# EAGLE design soundthings (EAGLE 7.7.0)
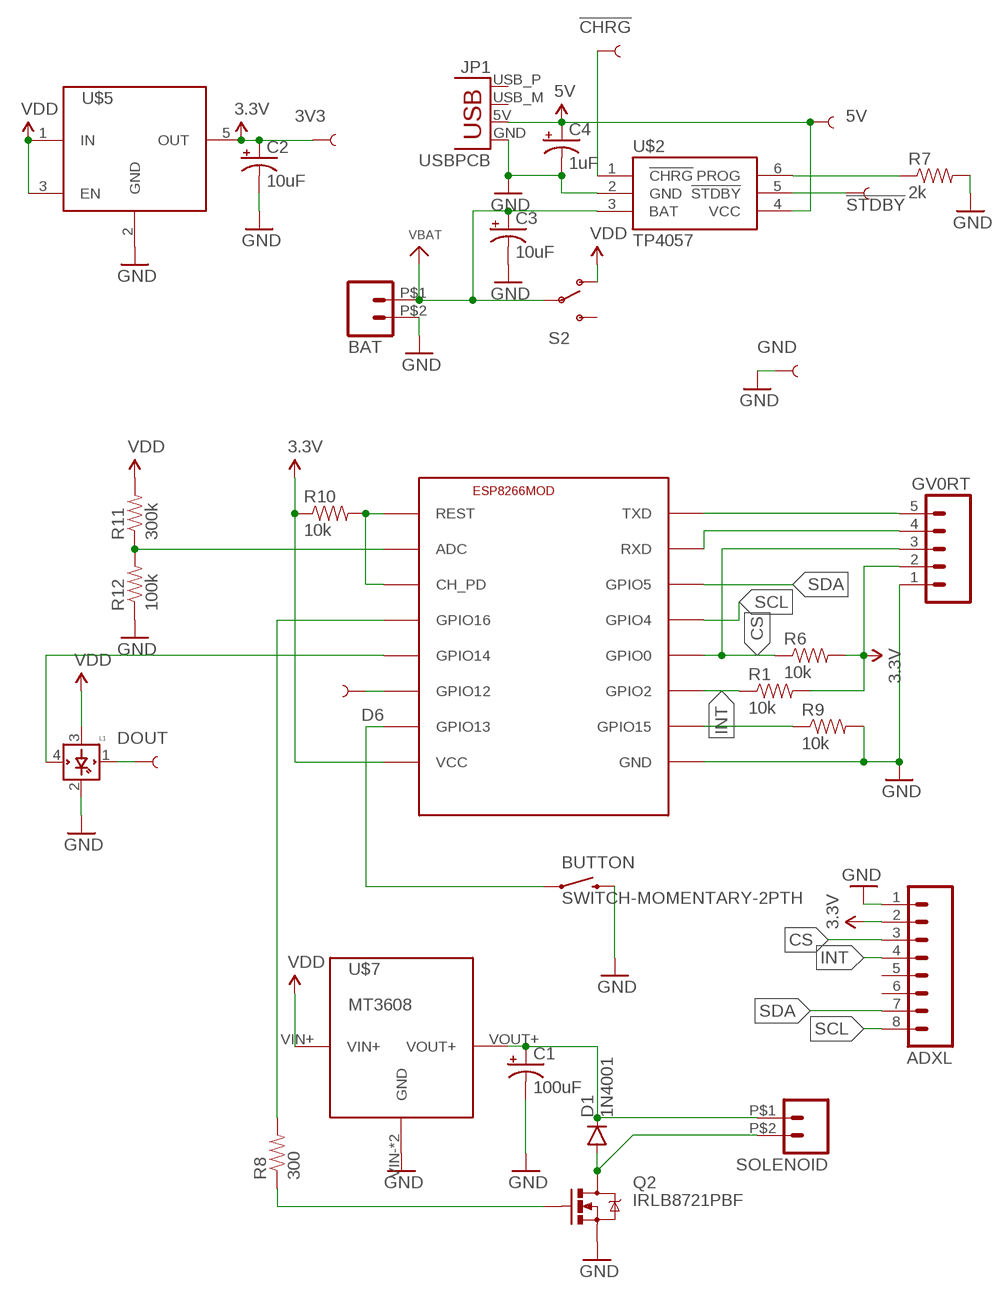
[diagram p0: schematic, sheet 1]

## Parts
3V3  TEST-POINTTP_15TH_THRU  [TP_15TH]
5V  TEST-POINTTP_15TH_THRU  [TP_15TH]
!CHRG  TEST-POINTTP_15TH_THRU  [TP_15TH]
!STDBY  TEST-POINTTP_15TH_THRU  [TP_15TH]
ADXL  M08LOCK  [1X08_LOCK]
BAT  M02PTH2  [1X02_BIG]
BUTTON  SWITCH-MOMENTARY-2PTH  [TACTILE-PTH]
C1  100uF  100UF-25V-20%(PTH)  [CPOL-RADIAL-100UF-25V]
C2  10uF  100UF-25V-20%(PTH)  [CPOL-RADIAL-100UF-25V]
C3  10uF  100UF-25V-20%(PTH)  [CPOL-RADIAL-100UF-25V]
C4  1uF  100UF-25V-20%(PTH)  [CPOL-RADIAL-100UF-25V]
D1  1N4001  DIODE1N4148  [DIODE-1N4148]
D6  TEST-POINTTP_15TH_THRU  [TP_15TH]
DOUT  TEST-POINTTP_15TH_THRU  [TP_15TH]
ESP8266MOD  ESP8266-07  [ESP-07]
GND  TEST-POINTTP_15TH_THRU  [TP_15TH]
GV0RT  M05LOCK  [1X05_LOCK]
JP1  USBPCB  [USB-A-PCB]
L1  WS2812BTH  [WS2812F5]
Q2  IRLB8721PBF  MOSFET-NCHANNELFQP30N06L  [TO220V]
R1  10k  RESISTORAXIAL-0.3  [AXIAL-0.3]
R6  10k  RESISTORAXIAL-0.3  [AXIAL-0.3]
R7  2k  RESISTORAXIAL-0.3  [AXIAL-0.3]
R8  300  RESISTORAXIAL-0.3  [AXIAL-0.3]
R9  10k  RESISTORAXIAL-0.3  [AXIAL-0.3]
R10  10k  RESISTORAXIAL-0.3  [AXIAL-0.3]
R11  300k  RESISTORAXIAL-0.3  [AXIAL-0.3]
R12  100k  RESISTORAXIAL-0.3  [AXIAL-0.3]
S2  SWITCH-SPDT-1  [MHS122-1]
SOLENOID  M02PTH2  [1X02_BIG]
U$2  TP4057  TP4057SOT-26-R  [SOT23-6]
U$5  TLV70233  [SOT23-5]
U$7  MT3608  [MT3608]

## Nets
3.3V: 3V3.P$1 ADXL.2 C2.1(+) ESP8266MOD.VCC GV0RT.2 R1.P$2 R6.P$2 R10.P$1 U$5.5(OUT)
5V [power]: 5V.P$1 C4.1(+) JP1.5V(VBUS) U$2.4(VCC)
!CHRG: !CHRG.P$1 U$2.1(!CHRG)
!STDBY: !STDBY.P$1 U$2.5(!STDBY)
ADC: ESP8266MOD.ADC R11.P$1 R12.P$2
CS: ADXL.3 ESP8266MOD.GPIO0 GV0RT.3 R6.P$1
DOUT: DOUT.P$1 L1.1(DOUT)
EN: ESP8266MOD.CH_PD ESP8266MOD.REST R10.P$2
GATE: Q2.1(G) R8.P$1
GND [ground]: ADXL.1 BAT.P$2 BUTTON.3 C1.2(-) C2.2(-) C3.2(-) C4.2(-) ESP8266MOD.GND GND.P$1 GV0RT.1 JP1.GND L1.2(GND) Q2.3(S) R7.P$2 R9.P$2 R12.P$1 U$2.2(GND) U$5.2(GND) U$7.VIN-(GND) U$7.VOUT-(GND)
GPIO12: D6.P$1 ESP8266MOD.GPIO12
GPIO13: BUTTON.1 ESP8266MOD.GPIO13
GPIO14: ESP8266MOD.GPIO14 L1.4(DIN)
GPIO15: ESP8266MOD.GPIO15 R9.P$1
GPIO16: ESP8266MOD.GPIO16 R8.P$2
INT: ADXL.4 ESP8266MOD.GPIO2 R1.P$1
N$11: R7.P$1 U$2.6(PROG)
RX: ESP8266MOD.RXD GV0RT.4
SCL: ADXL.8 ESP8266MOD.GPIO5(GPIO4)
SDA: ADXL.7 ESP8266MOD.GPIO4(GPIO5)
SOL- [power]: D1.A Q2.2(D) SOLENOID.P$2
TX: ESP8266MOD.TXD GV0RT.5
VBAT [power]: BAT.P$1 C3.1(+) S2.2(P) U$2.3(BAT)
VDD: L1.3(VDD) R11.P$2 S2.1(O) U$5.1(IN) U$5.3(EN) U$7.VIN+
VOUT+ [power]: C1.1(+) D1.C SOLENOID.P$1 U$7.VOUT+
Unconnected: ADXL.5 ADXL.6 JP1.USB_M(D-) JP1.USB_P(D+) S2.3(S)

## Library data of the parts
3V3 5V !CHRG !STDBY D6 DOUT GND = SparkFun-Passives:TEST-POINT: Bare copper test points for troubleshooting or ICT
ADXL = SparkFun-Connectors:M08: Header 8 Standard 8-pin 0.1" header. Use with straight break away headers (SKU : PRT-00116), right angle break away headers (PRT-00553), swiss pins (PRT-00743), machine pins (PRT-00117), and female headers (PRT-00115).
BAT SOLENOID = SparkFun-Connectors:M02: Standard 2-pin 0.1" header. Use with - straight break away headers ( PRT-00116) - right angle break away headers (PRT-00553) - swiss pins (PRT-00743) - machine pins (PRT-00117) - female headers (PRT-00115) Molex polarized connector foot print use with: PRT-08233 with associated crimp pins and housings. 2.54_SCREWTERM for use with PRT-10571. 3.5mm Screw Terminal footprints for PRT-08084 5mm Screw Terminal footprints for use with PRT-08432
BUTTON = SparkFun-Electromechanical:SWITCH-MOMENTARY-2: Various NO switches- pushbuttons, reed, etc; PROD_ID: SWCH-08441
C1-C4 = SparkFun-Capacitors:100UF-25V-20%(PTH): CAP-08439; PROD_ID: CAP-08439
D1 = SparkFun-DiscreteSemi:DIODE: Diode These are standard reverse protection diodes and small signal diodes. SMA package can handle up to about 1A. SOD-323 can handle about 200mA. What the SOD-323 package when ordering, there are some mfgs out there that are 5-pin packages.
ESP8266MOD = lio:ESP8266
GV0RT = SparkFun-Connectors:M05: Header 5 Standard 5-pin 0.1" header. Use with straight break away headers (SKU : PRT-00116), right angle break away headers (PRT-00553), swiss pins (PRT-00743), machine pins (PRT-00117), and female headers (PRT-00115). Molex polarized connector foot print use with SKU : PRT-08230 with associated crimp pins and housings.
JP1 = SparkFun-Connectors:USB: USB Connectors USB-B-PTH is fully proven SKU : PRT-00139/CONN-08278 USB-miniB is fully proven SKU : PRT-00587 USB-A-PCB is untested. USB-A-H is throughly reviewed, but untested. Spark Fun Electronics SKU : PRT-00437 USB-B-SMT is throughly reviewed, but untested. Needs silkscreen touching up. USB-A-S has not been used/tested USB-MB-H has not been used/tested USB-MICROB has been used. CONN-09505
L1 = lio:WS2812B
Q2 = SparkFun-DiscreteSemi:MOSFET-NCHANNEL: Common NMOSFET Parts MFG P/N Store ID Prod ID FDD8780 TRANS-09984 SI7820DN TRANS-11055 FDS6630A IC-08089 2N7002PW TRANS-11151 FQP30N06L COM-10213 TRANS-10060 BSS123LT1G TRANS-08345 BSS138 TRANS-00830 BS170 2N7000; PROD_ID: TRANS-10060
R1 R6-R12 = SparkFun-Passives:RESISTOR: Resistor Basic schematic elements and footprints for 0603, 1206, and PTH resistors.
S2 = lio:SWITCH-SPDT: SPDT Switch Simple slide switch, Spark Fun Electronics SKU : COM-00102 DPDT SMT slide switch, AYZ0202, SWCH-08179
U$2 = lio:TP4057: 500mA linear li-ion battery charger tp4057 actual charge current to 500ma, dual-lamp indication, reverse battery protection. Alternative to MAX1551 or MAX1555 (not compatible!) Datasheet from TP micro: http://www.tpmicro.com/datasheet/TP4057Ver1.0_preview.pdf http://www.tp-asic.com/te_product_a/2009-05-20/33.chtml
U$5 = lio:TLV702
U$7 = lio:MT3608

## Net classes
0 default: width 0.203 mm, clearance 0.203 mm
1 ground: width 0.406 mm, clearance 0.305 mm
2 power: width 0.406 mm, clearance 0.305 mm

## Board
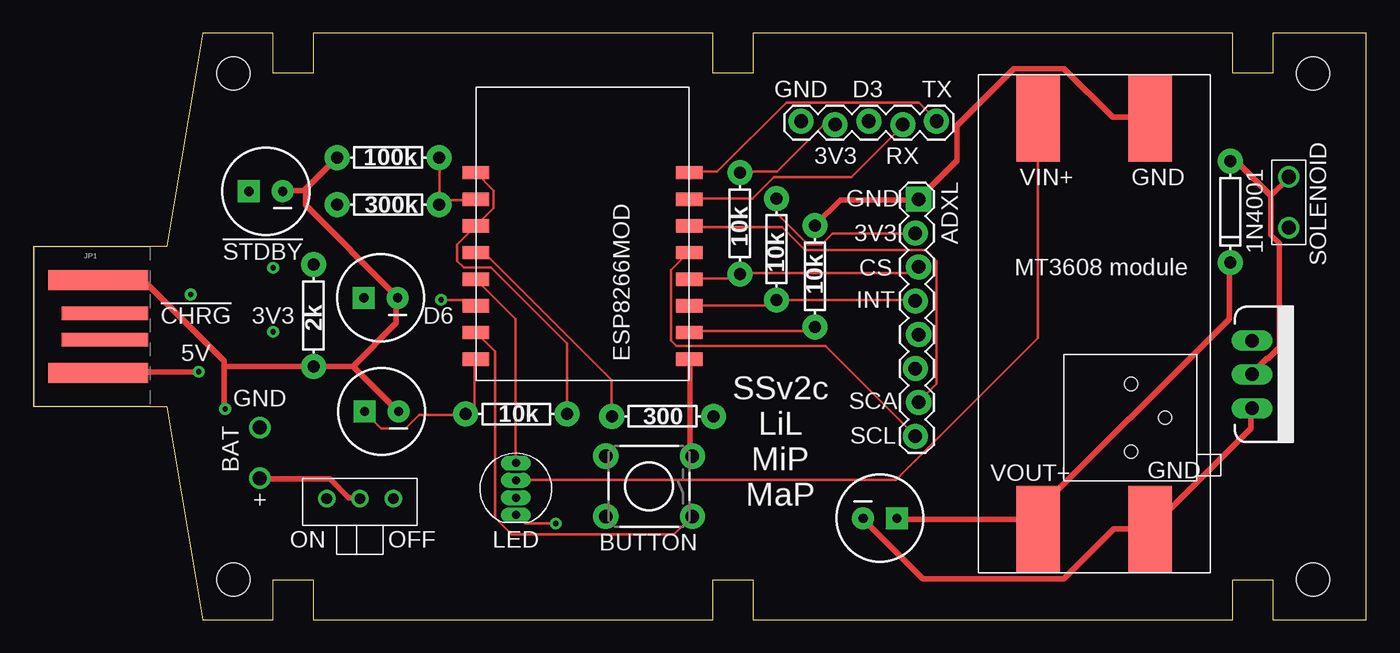
[diagram p1: board, top side]
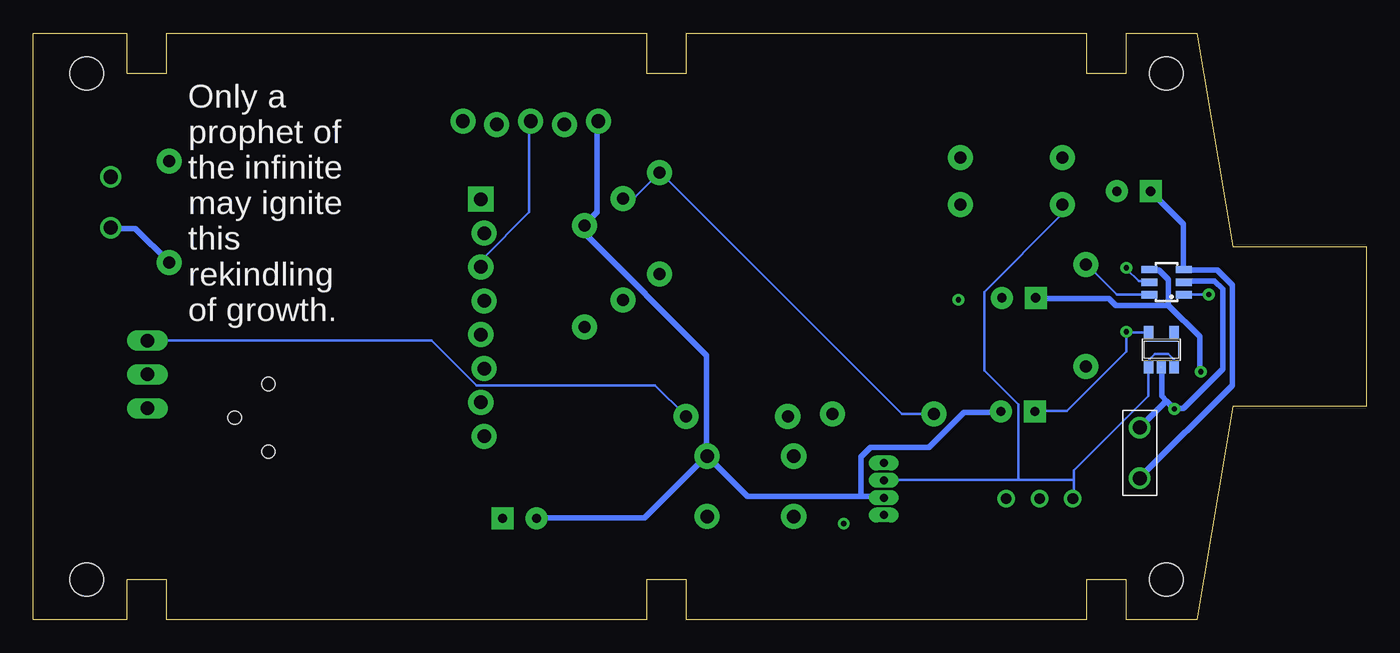
[diagram p2: board, bottom side, seen from below]

Size 100 x 44 mm. Coordinates in mm from the lower left corner, seen from the top.
Outline: 0,16 10,16 12.7,0 18,0 18,3 21,3 21,0 51,0 51,3 54,3 54,0 90,0 90,3 93,3 93,0 100,0 100,44 93,44 93,41 90,41 90,44 54,44 54,41 51,41 51,44 21,44 21,41 18,41 18,44 12.7,44 10,28 0,28 0,16
Copper layers (1*16): Top 0.035mm / dielectric 1.5mm / Bottom 0.035mm
Design rules "dirt_cheap_dirty_boards.v1b": minimum track width 5mil, minimum drill 12mil, track to track 5mil, track to pad 5mil, pad to pad 5mil, via to via 5mil, smd to smd 0mil, copper to edge 10mil, drill to drill 10mil, minimum pad ring 10mil, minimum via ring 6mil, stop-mask expansion 2mil, vias tented up to drill 25mil, thermal gap 10mil
Holes 2.5 mm at 96,3 15,41 15,3 96,41
tRestrict: area 0,19 to 8.4,25
bRestrict: area 0,16 to 9,28

### Footprints (pad centres in the part's own frame; a part is rotated, then mirrored left to right if it is on the bottom)
TP_15TH = drill 0.381 pad 0.61: P$1 0,0
1X08_LOCK = drill 1.016 pad 1.88 square: 1 0,0.127 | drill 1.016 pad 1.88: 2 2.54,-0.127; 3 5.08,0.127; 4 7.62,-0.127; 5 10.16,0.127; 6 12.7,-0.127; 7 15.24,0.127; 8 17.78,-0.127
1X02_BIG = drill 1.067: P$1 0,0; P$2 3.81,0
TACTILE-PTH = drill 1.016 pad 1.88: 1 -3.251,2.261; 2 3.251,2.261; 3 -3.251,-2.261; 4 3.251,-2.261
CPOL-RADIAL-100UF-25V = drill 0.7 pad 1.651 square: 1 1.27,0 | drill 0.7 pad 1.651: 2 -1.27,0
DIODE-1N4148 = drill 0.9 pad 1.88: A -3.81,0; C 3.81,0
ESP-07 = smd 1 x 2: ADC -1.6,-8; CH_PD 0.4,-8; GND 10.4,8; GPIO0 4.4,8; GPIO2 6.4,8; GPIO4 0.4,8; GPIO5 2.4,8; GPIO12 6.4,-8; GPIO13 8.4,-8; GPIO14 4.4,-8; GPIO15 8.4,8; GPIO16 2.4,-8; REST -3.6,-8; RXD -1.6,8; TXD -3.6,8; VCC 10.4,-8
1X05_LOCK = drill 1.016 pad 1.88: 1 0,0.127; 2 2.54,-0.127; 3 5.08,0.127; 4 7.62,-0.127; 5 10.16,0.127
USB-A-PCB = smd 7.5 x 1.5: 5V -0.2,-3.5; GND -0.2,3.5 | smd 6.5 x 1: USB_M 0.3,-1; USB_P 0.3,1
WS2812F5 = drill 0.6 long: 1 1.95,0; 2 0.65,0; 3 -0.65,0; 4 -1.95,0
TO220V = drill 1.016 long: 1 -2.54,0; 2 0,0; 3 2.54,0
AXIAL-0.3 = drill 0.9 pad 1.88: P$1 -3.81,0; P$2 3.81,0
MHS122-1 = drill 0.8: 1 -2.5,0; 2 0,0; 3 2.5,0
SOT23-6 = smd 0.55 x 1.2: 1 -0.95,-1.3; 2 0,-1.3; 3 0.95,-1.3; 4 0.95,1.3; 5 0,1.3; 6 -0.95,1.3
SOT23-5 = smd 0.69 x 0.99: 1 -0.95,-1.29; 2 0,-1.29; 3 0.95,-1.29; 4 0.95,1.3; 5 -0.95,1.3
MT3608 = smd 3.251 x 6.452: VIN+ -4.2,15.4; VIN- 4.2,15.4; VOUT+ -4.2,-15.4; VOUT- 4.2,-15.4 | hole 1: 2.76,-9.6; 2.76,-4.52; 5.3,-7.06

### Placement (x,y rotation side)
3V3  18,21.6 0 top
5V  12.4,18.6 0 top
!CHRG  11.8,24.4 0 top
!STDBY  18,26.4 0 top
ADXL  66.3,31.54 270 top
BAT  16.99,10.6 90 bottom
BUTTON  46.2,10 180 top
C1  63.52,7.6 0 top
C2  26.13,15.62 180 top
C3  17.44,32.14 180 top
C4  26.06,24.14 180 top
D1  89.8,30.61 270 top
D6  30.6,24 0 top
DOUT  39.2,7.2 0 top
ESP8266MOD  41.2,29.94 270 top
GND  14.4,15.8 0 top
GV0RT  57.61,37.28 0 top
JP1  5.08,22 0 top
L1  36.2,9.8 270 top
Q2  91.43,18.4 270 top
R1  55.75,27.8 90 top
R6  53.01,29.74 90 top
R7  21.02,22.82 270 top
R8  47.21,15.26 180 top
R9  58.65,25.76 90 top
R10  36.24,15.42 0 top
R11  26.62,31.14 180 top
R12  26.62,34.68 0 top
S2  24.51,9.08 0 top
SOLENOID  94.19,29.41 90 top
U$2  14.97,25.32 90 bottom
U$5  15.37,20.24 0 bottom
U$7  79.6,22.2 0 top

### Tracks (layer width: path | path; a pad name or v marks a point on that pad's centre or on a via)
3.3V
  Top 0.203: ESP8266MOD.VCC 33.12,19.51 33.12,16.05 32.51,15.44 R10.P$1 32.41,15.34 28.96,15.34 27.94,14.33 26.11,14.33 24.89,15.54 C2.1 | ADXL.2 66.14,28.96 59.94,28.96 59.13,28.14 58.12,28.14 55.78,30.48 55.78,31.6 R1.P$2 | GV0RT.2 60.15,37.08 59.23,37.08 55.78,33.63 53.03,33.63 R6.P$2
  Bottom 0.203: U$5.5 16.36,21.54 17.98,21.54 3V3.P$1 17.98,21.44 17.98,20.12 22.45,15.65 24.79,15.65 C2.1 | R1.P$2 55.68,31.7 54.86,31.7 53.03,33.53 R6.P$2 52.93,33.53 34.85,15.44 32.51,15.44 R10.P$1
5V
  Top 0.406: JP1.5V 4.98,18.59 5V.P$1
  Bottom 0.406: 14.83,23.57 14.83,25.5 15.54,26.21 16.26,26.21 U$2.4 | 14.83,23.57 12.5,21.23 12.5,18.69 5V.P$1 | 14.83,23.57 18.8,23.57 19.3,24.08 24.69,24.08 C4.1
!CHRG
  Bottom 0.203: U$2.1 13.61,24.38 11.89,24.38 !CHRG.P$1
!STDBY
  Bottom 0.203: U$2.5 16.36,25.4 17.07,25.4 17.98,26.31 !STDBY.P$1
ADC
  Top 0.203: ESP8266MOD.ADC 33.12,31.5 30.79,31.5 30.48,31.19 R11.P$1 30.68,31.5 30.48,31.7 30.48,34.65 R12.P$2
CS
  Top 0.203: ESP8266MOD.GPIO0 49.28,25.6 52.63,25.6 52.93,25.91 R6.P$1 53.03,26.01 65.94,26.01 66.34,26.42 ADXL.3
  Bottom 0.203: ADXL.3 66.34,26.52 66.34,27.03 62.79,30.58 62.79,37.39 GV0RT.3
DOUT
  Top 0.203: DOUT.P$1 39.12,7.21 36.88,7.21 36.27,7.82 L1.1
EN
  Top 0.203: ESP8266MOD.REST 33.22,33.53 34.54,32.21 34.54,30.89 33.22,29.57 ESP8266MOD.CH_PD 33.12,29.46 31.8,28.14 31.8,26.92 32.31,26.42 34.34,26.42 40.03,20.73 40.03,15.44 R10.P$2
GATE
  Bottom 0.203: Q2.1 91.34,20.93 70.1,20.93 66.75,17.58 53.34,17.58 51.1,15.34 R8.P$1
GND
  Top 0.406: 20.32,32.21 18.8,32.21 C3.2 | 20.32,32.21 22.76,34.65 R12.P$1 | 23.98,19 27.33,15.65 C2.2 | 23.98,19 21.03,19 R7.P$2 20.83,19 14.33,19 | 23.98,19 27.23,22.25 27.23,24.08 C4.2 27.23,24.28 20.42,31.09 20.42,32.11 20.32,32.21 | 14.33,19 14.33,15.85 GND.P$1 | 14.33,19 14.33,19.41 8.33,25.4 4.98,25.4 JP1.GND | R9.P$2 58.73,29.67 60.55,31.5 66.34,31.5 ADXL.1 66.55,31.7 69.29,34.44 69.29,37.08 73.56,41.35 77.32,41.35 80.97,37.69 83.72,37.69 U$7.VIN- | Q2.3 91.34,15.85 91.34,14.33 83.82,6.81 U$7.VOUT- 83.62,6.81 81.08,6.81 77.32,3.05 66.75,3.05 62.28,7.52 C1.2 | ESP8266MOD.GND 49.28,19.51 49.28,12.39 49.38,12.29 BUTTON.3
  Bottom 0.406: 14.99,16.41 14.43,15.85 GND.P$1 14.22,15.85 13.72,15.85 10.77,18.8 10.77,24.79 11.38,25.4 13.61,25.4 U$2.2 | 14.99,16.41 15.34,16.76 15.34,18.9 U$5.2 | 14.99,16.41 16.97,14.43 BAT.P$2 | GV0RT.1 57.71,37.39 57.71,30.58 58.62,29.67 R9.P$2 58.62,29.36 58.62,28.96 49.48,19.81 49.48,12.39 BUTTON.3 | 37.9,9.25 46.43,9.25 49.38,12.19 BUTTON.3 | 37.9,9.25 36.27,9.25 L1.2 | C1.2 62.18,7.62 54.15,7.62 49.58,12.19 BUTTON.3 | 37.9,9.25 37.9,12.19 37.19,12.9 32.82,12.9 30.18,15.54 27.43,15.54 C2.2
GPIO12
  Top 0.203: D6.P$1 30.68,23.98 32.72,23.98 33.12,23.57 ESP8266MOD.GPIO12
GPIO13
  Top 0.203: ESP8266MOD.GPIO13 33.22,21.54 34.65,20.12 34.65,7.62 35.87,6.4 48.06,6.4 49.38,7.72 BUTTON.1
GPIO14
  Top 0.203: ESP8266MOD.GPIO14 33.22,25.5 36.17,22.55 36.17,11.79 L1.4
GPIO15
  Top 0.203: ESP8266MOD.GPIO15 49.28,21.64 58.32,21.64 58.62,21.95 R9.P$1
GPIO16
  Top 0.203: ESP8266MOD.GPIO16 33.22,27.53 33.83,27.53 43.38,17.98 43.38,15.34 R8.P$2
INT
  Top 0.203: ESP8266MOD.GPIO2 49.28,23.57 55.27,23.57 55.68,23.98 R1.P$1 55.78,23.98 66.14,23.98 ADXL.4
N$11
  Bottom 0.203: U$2.6 16.36,24.38 18.69,24.38 20.93,26.62 R7.P$1
RX
  Top 0.203: ESP8266MOD.RXD 49.28,31.6 53.95,31.6 55.58,33.22 61.37,33.22 65.23,37.08 GV0RT.4
SCL
  Top 0.203: ESP8266MOD.GPIO5 49.17,27.53 47.85,26.21 47.85,20.93 48.26,20.52 59.44,20.52 66.14,13.82 ADXL.8
SDA
  Top 0.203: ESP8266MOD.GPIO4 49.28,29.46 56.19,29.46 57.91,27.74 66.95,27.74 67.77,26.92 67.77,17.68 66.45,16.36 ADXL.7
SOL-
  Top 0.406: 92.86,31.8 92.86,28.85 93.47,28.25 93.47,20.42 92.66,19.61 92.56,19.61 91.44,18.49 Q2.2 | 92.86,31.8 94.18,33.12 SOLENOID.P$2 | 92.86,31.8 90.32,34.34 89.81,34.34 D1.A
TX
  Top 0.203: ESP8266MOD.TXD 49.28,33.63 51.31,33.63 56.49,38.81 66.45,38.81 67.77,37.49 GV0RT.5
VBAT
  Top 0.406: S2.2 24.49,9.14 23.67,9.14 22.25,10.57 17.07,10.57 BAT.P$1
  Bottom 0.406: C3.1 16.15,32.11 13.72,29.67 13.72,26.31 U$2.3 13.51,26.21 11.18,26.21 10.06,25.09 10.06,17.58 16.97,10.67 BAT.P$1
VDD
  Top 0.203: U$7.VIN+ 75.39,37.59 75.39,21.13 64.72,10.46 36.27,10.46 L1.3
  Bottom 0.203: U$5.3 14.43,19 14.43,19.51 14.83,19.91 15.85,19.91 16.26,19.51 16.26,19 U$5.1 16.36,18.9 16.36,16.76 21.95,11.18 21.95,10.46 | 21.95,10.46 21.95,9.14 S2.1 | 21.95,10.46 26.11,10.46 | 26.11,10.46 36.17,10.46 L1.3 | 26.11,10.46 26.11,16.15 28.65,18.69 28.65,24.59 22.86,30.38 22.86,31.09 R11.P$2
VOUT+
  Top 0.406: C1.1 64.82,7.52 74.68,7.52 75.39,6.81 U$7.VOUT+ 74.78,7.62 89.71,22.55 89.71,26.72 D1.C
  Bottom 0.406: SOLENOID.P$1 94.18,29.36 92.35,29.36 89.81,26.82 D1.C

### Text on the board
tNames: GND | D3 | TX | 3V3 | RX | VIN+ | GND | GND | SOLENOID | 3V3 | !STDBY | CS | INT | !CHRG | 3V3 | D6 | 5V | GND | SCA | SCL | BAT | SSv2c / LiL / MiP / MaP | VOUT+ | GND | + | ON | OFF | LED
bNames: Only a / prophet of / the infinite / may ignite / this / rekindling / of growth.